# Altium schematic sheet misc.SchDoc: SCOPE-F07x: misc
size A4; Organization: Draw By: OldGerman; Address2: https://github.com; Address3: /oldgerman/SCOPE-F07x; Revision: v1.1; SheetNumber: 5; SheetTotal: 5
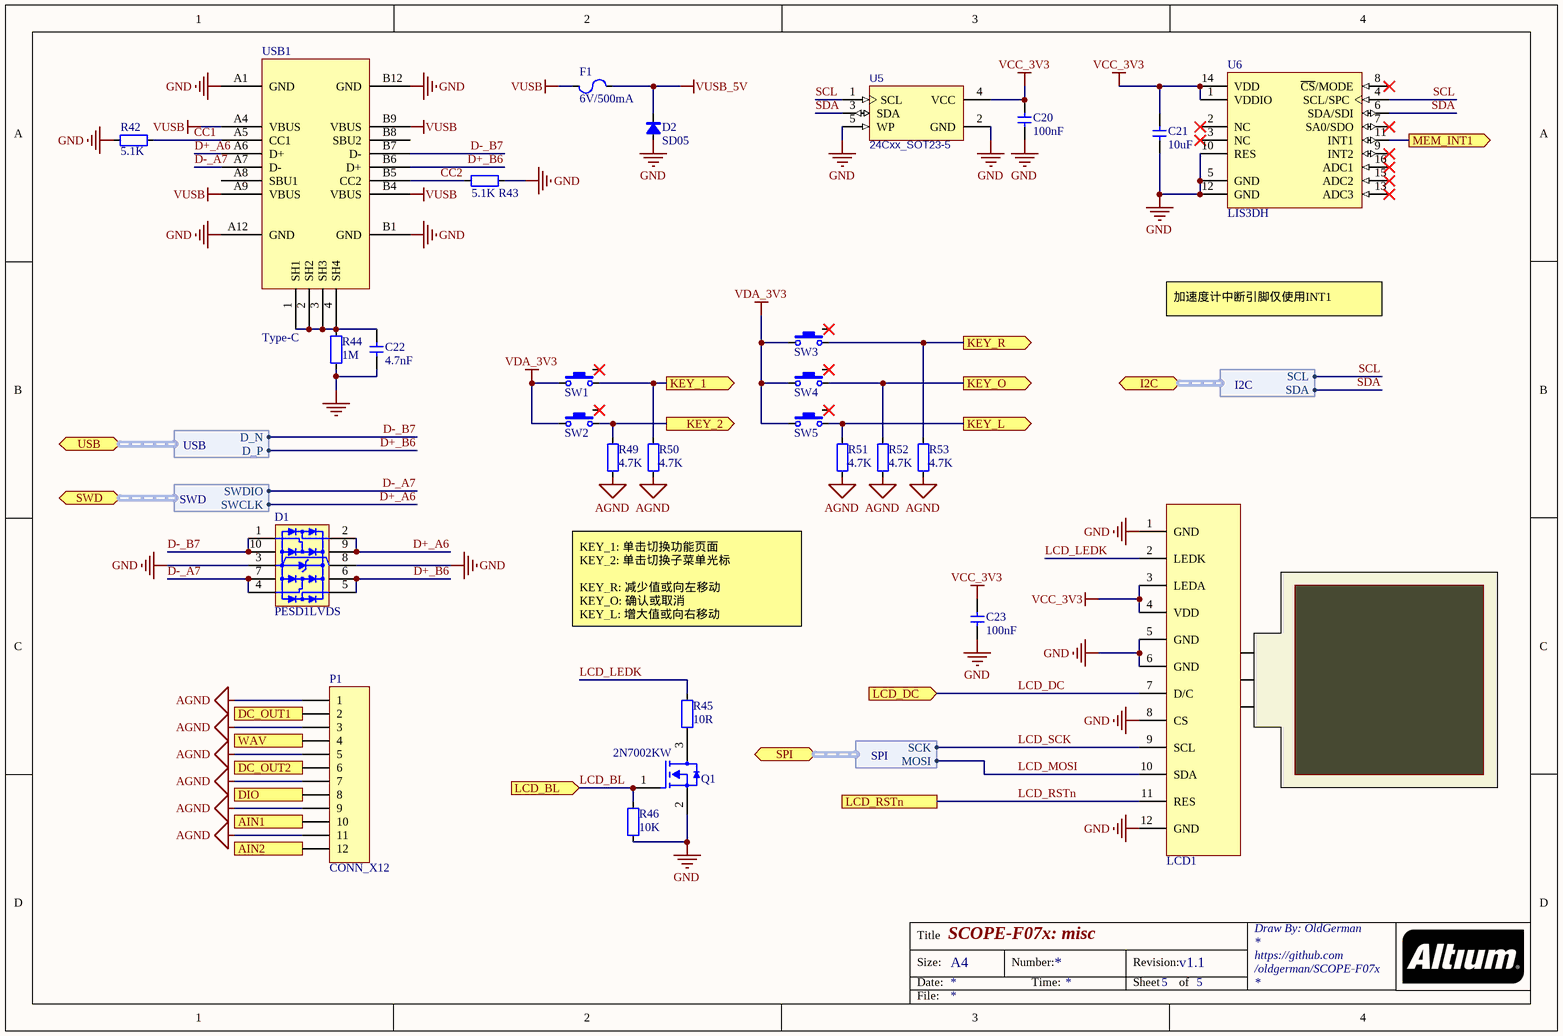
[diagram p0: misc.SchDoc]

## Parts
C20  100nF  [C0402]
C21  10uF  [C0402]
C22  4.7nF  [C0402]
C23  100nF  [C0402]
D1  PESD1LVDS  [DFN2510-10_SOT1165-1]
D2  SD05  [SOD-323]
F1  6V/500mA  [FUSE0603_0.5MM]
LCD1  LCD_240x240  [LCD-240X240-1.54INCH_FLUSH_FRONT]  (value not drawn)
P1  CONN_X12  [2.54MM_FEMALE_1x12_180H]
Q1  2N7002KW  [DIODES SOT-323-3]
R42  5.1K  [R0402]
R43  5.1K  [R0402]
R44  1M  [R0402]
R45  10R  [R0603]
R46  10K  [R0402]
R49  4.7K  [R0402]
R50  4.7K  [R0402]
R51  4.7K  [R0402]
R52  4.7K  [R0402]
R53  4.7K  [R0402]
SW1  Button-2P+PAD  [TACTILE_SWITCH_SMD_4.6x1.82x3.5mm_1TS003B]  (value not drawn)
SW2  Button-2P+PAD  [TACTILE_SWITCH_SMD_4.6x1.82x3.5mm_1TS003B]  (value not drawn)
SW3  Button-2P+PAD  [TACTILE_SWITCH_SMD_4.6x1.82x3.5mm_1TS003B]  (value not drawn)
SW4  Button-2P+PAD  [TACTILE_SWITCH_SMD_4.6x1.82x3.5mm_1TS003B]  (value not drawn)
SW5  Button-2P+PAD  [TACTILE_SWITCH_SMD_4.6x1.82x3.5mm_1TS003B]  (value not drawn)
U5  24Cxx_SOT23-5  [MICROCHIP SOT-23-5 OT]
U6  LIS3DH  [LGA-16-3X3]
USB1  Type-C  [Type-C-TOP]

## Ports
AIN1 (out), AIN2 (out), DC_OUT1 (in), DC_OUT2 (in), DIO (in), I2C (bidir, harness I2C), KEY_1 (out), KEY_2 (out), KEY_L (out), KEY_O (out), KEY_R (out), LCD_BL (in), LCD_DC (in), LCD_RSTn, MEM_INT1 (out), SPI (bidir, harness SPI), SWD (bidir, harness SWD), USB (bidir, harness USB), WAV (in)

## Harnesses
USB: D_P, D_N
SWD: SWCLK, SWDIO
I2C: SDA, SCL
SPI: MOSI, SCK

## Nets
AGND: P1.1 P1.3 P1.5 P1.7 P1.9 P1.11 R49.2 R50.2 R51.2 R52.2 R53.2
GND: C20.2 C21.2 C22.2 C23.1 D1.3(GND) D1.8(GND) D2.1(A) LCD1.1(GND) LCD1.5(GND) LCD1.6(GND) LCD1.8(CS) LCD1.12(GND) Q1.2(S) R42.2 R43.1 R44.2 R46.1 U5.2(GND) U5.5(WP) U6.5(GND) U6.10(RES) U6.12(GND) USB1.A1(GND) USB1.A12(GND) USB1.B1(GND) USB1.B12(GND)
VCC_3V3: C20.1 C21.1 C23.2 LCD1.3(LEDA) LCD1.4(VDD) U5.4(VCC) U6.1(VDDIO) U6.14(VDD)
VDA_3V3: SW1.1 SW2.1 SW3.1 SW4.1 SW5.1
VUSB: F1.1 USB1.A4(VBUS) USB1.A9(VBUS) USB1.B4(VBUS) USB1.B9(VBUS)
VUSB_5V: D2.2(C) F1.2
AIN1: P1.10 ; port AIN1
AIN2: P1.12 ; port AIN2
CC1: R42.1 USB1.A5(CC1)
CC2: R43.2 USB1.B5(CC2)
D+_A6: D1.2(I/O) D1.9(GND) USB1.A6(D+) ; port SWD.SWCLK
D+_B6: D1.5(I/O) D1.6(GND) USB1.B6(D+) ; port USB.D_P
D-_A7: D1.4(I/O) D1.7(GND) USB1.A7(D-) ; port SWD.SWDIO
D-_B7: D1.1(I/O) D1.10(GND) USB1.B7(D-) ; port USB.D_N
DC_OUT1: P1.2 ; port DC_OUT1
DC_OUT2: P1.6 ; port DC_OUT2
DIO: P1.8 ; port DIO
KEY_1: R50.1 SW1.2 ; port KEY_1
KEY_2: R49.1 SW2.2 ; port KEY_2
KEY_L: R51.1 SW5.2 ; port KEY_L
KEY_O: R52.1 SW4.2 ; port KEY_O
KEY_R: R53.1 SW3.2 ; port KEY_R
LCD_BL: Q1.1(G) R46.2 ; port LCD_BL
LCD_DC: LCD1.7(D/C) ; port LCD_DC
LCD_LEDK: LCD1.2(LEDK) R45.2
LCD_MOSI: LCD1.10(SDA) ; port SPI.MOSI
LCD_RSTn: LCD1.11(RES) ; port LCD_RSTn
LCD_SCK: LCD1.9(SCL) ; port SPI.SCK
MEM_INT1: U6.11(INT1) ; port MEM_INT1
SCL: U5.1(SCL) U6.4(SCL/SPC) ; port I2C.SCL
SDA: U5.3(SDA) U6.6(SDA/SDI) ; port I2C.SDA
WAV: P1.4 ; port WAV
NetC22_1: C22.1 R44.1 USB1.1(SH1) USB1.2(SH2) USB1.3(SH3) USB1.4(SH4)
NetQ1_3: Q1.3(D) R45.1

Not connected (* = marked no-connect by the designer): SW1 3*; SW2 3*; SW3 3*; SW4 3*; SW5 3*; U6 2(NC)* 3(NC)* 7(SA0/SDO)* 8(~{CS}/MODE)* 9(INT2)* 13(ADC3)* 15(ADC2)* 16(ADC1)*; USB1 A8(SBU1) B8(SBU2)

## Notes on the sheet
- 加速度计中断引脚仅使用INT1
- KEY_1: 单击切换功能页面
  KEY_2: 单击切换子菜单光标
  KEY_R: 减少值或向左移动
  KEY_O: 确认或取消
  KEY_L: 增大值或向右移动
- Title
- Size:
- Date:
- A4
- Number:
- Time:
- Revision:
- Sheet
- of
- File:

## Library data of the parts
C20-C23 = CAP: Capacitor; Value: 0.1u
D1 = PESD1LVDS: Ultra-Low Capacitance TVS Protection; BOM名称: 钳位IC; 版权归属: 源创客; 属性: 30V/0.2A; 学习资源: www.ooocke.com
D2 = DIODE: 单向 5V TVS
F1 = FUSE: 贴片自恢复保险丝
Q1 = N-MOS_123: N-MOS
R42-R46 R49-R53 = RES: Resistor; Value: 22R
SW1-SW5 = Button-2P+PAD: Button
U6 = LIS3DH: The LIS3DH is an ultra-low-power highperformance three-axis linear accelerometer belonging to the “nano” family, with digital I2C/SPI serial interface standard output. The device features ultra-low-power operational modes that allow advanced power saving and smart embedded functions.; ComponentLink1Description: Datasheet; ComponentLink1URL: https://www.bosch-sensortec.com/media/boschsensortec/downloads/datasheets/bst-bmi160-ds000.pdf
USB1 = USB-Type-C_16P